# Altium schematic sheet Power_Supplies.SchDoc: =DocumentName
size A4; DocumentNumber: 1; Revision: 0; SheetNumber: 1; SheetTotal: 18; Last modified by: Maciej Przybysz
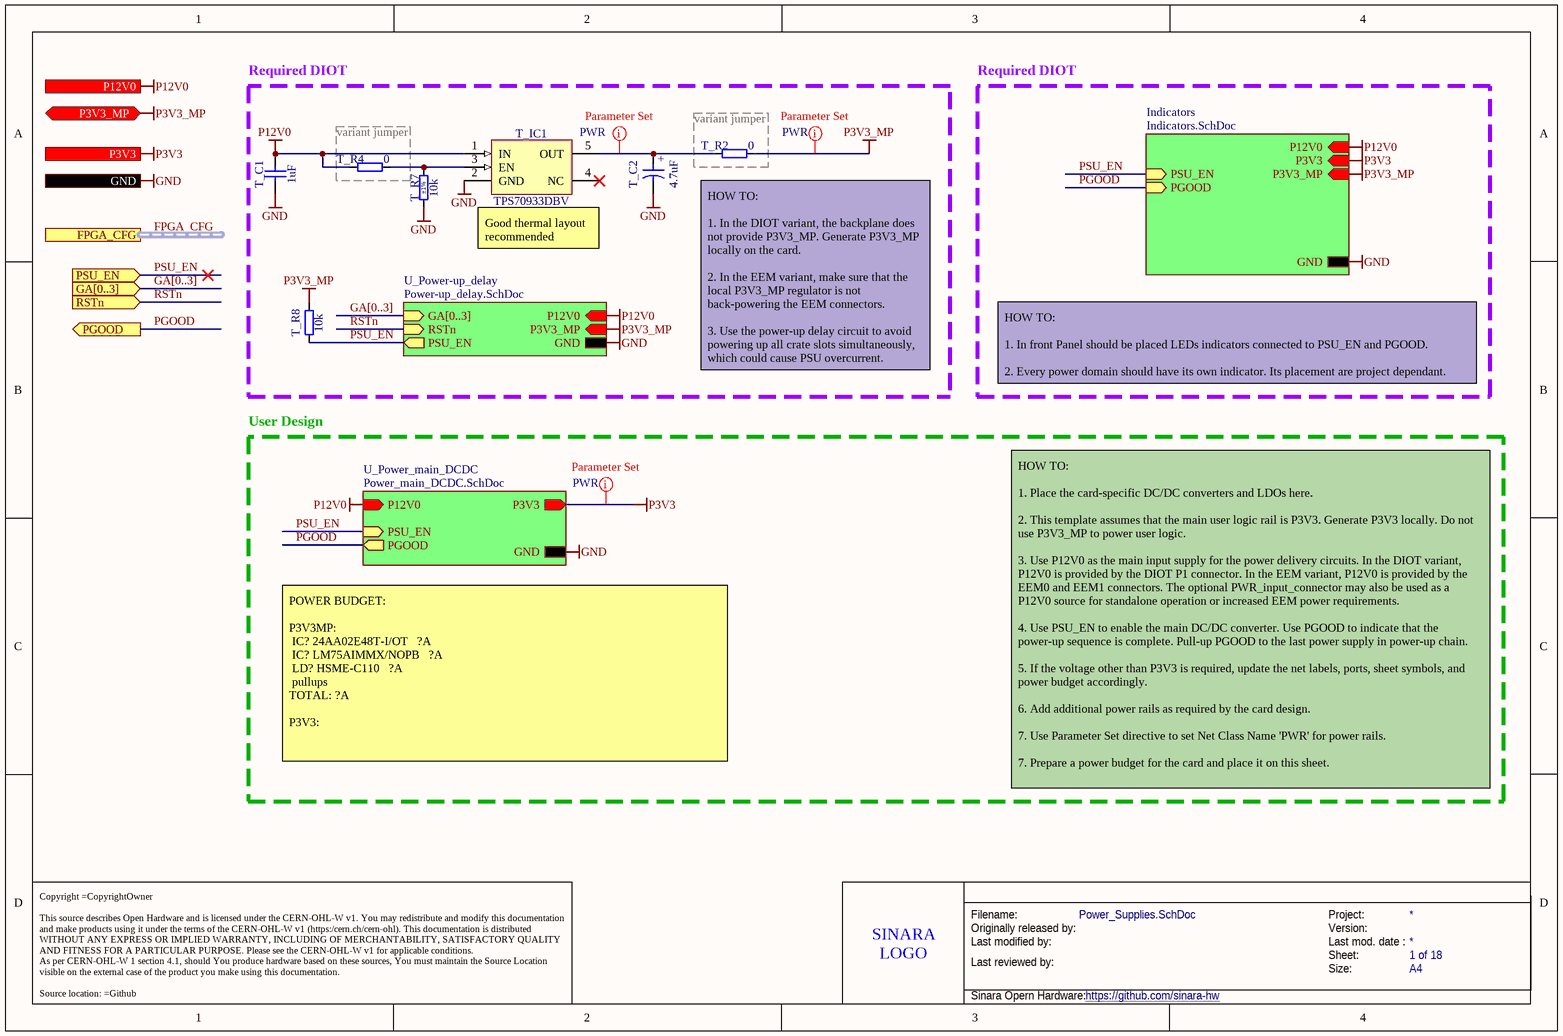
[diagram p0: Power_Supplies.SchDoc]

## Parts
T_C1  1uF  [CAPC1608X87N]
T_C2  4.7uF  [CAPMP3216X180N]
T_IC1  TPS70933DBV  [SOT95P280X145-5N]
T_R2  0  [RESC1005X40N]
T_R4  0  [RESC1005X40N]
T_R7  10k  Tolerance: ±1%  [RESC1005X40N]
T_R8  10k  [RESC1608X55N]

## Blocks framed on the sheet
variant jumper: T_R4
variant jumper: T_R2

## Sub-sheets
Indicators = Indicators.SchDoc: PSU_EN (in), PGOOD (in), GND, P3V3_MP (in), P12V0 (in), P3V3 (in)
U_Power-up_delay = Power-up_delay.SchDoc: GA[0..3] (in), RSTn (in), GND, PSU_EN (out), P3V3_MP (in), P12V0 (in)
U_Power_main_DCDC = Power_main_DCDC.SchDoc: P12V0 (in), P3V3 (out), GND, PSU_EN (in), PGOOD (out)

## Ports
FPGA_CFG (harness FPGA_CFG), GA[0..3] (in), GND, P3V3 (out), P3V3_MP (bidir), P12V0 (in), PGOOD (out), PSU_EN (in), RSTn (in)

## Nets
GND: T_C1.1 T_C2.2 T_IC1.2(GND) T_R7.1 ; port GND, sheet U_Power-up_delay/GND, sheet U_Power_main_DCDC/GND, sheet Indicators/GND
P3V3: port P3V3, sheet U_Power_main_DCDC/P3V3, sheet Indicators/P3V3
P3V3_MP: T_R2.2 T_R8.2 ; port P3V3_MP, sheet U_Power-up_delay/P3V3_MP, sheet Indicators/P3V3_MP
P12V0: T_C1.2 T_IC1.1(IN) T_R4.1 ; port P12V0, sheet U_Power-up_delay/P12V0, sheet U_Power_main_DCDC/P12V0, sheet Indicators/P12V0
PGOOD: port PGOOD, sheet U_Power_main_DCDC/PGOOD, sheet Indicators/PGOOD
PSU_EN: T_R8.1 ; port PSU_EN, sheet U_Power-up_delay/PSU_EN, sheet U_Power_main_DCDC/PSU_EN, sheet Indicators/PSU_EN
RSTn: port RSTn, sheet U_Power-up_delay/RSTn
NetT_C2_1: T_C2.1 T_IC1.5(OUT) T_R2.1
NetT_IC1_3: T_IC1.3(EN) T_R4.2 T_R7.2

Not connected (* = marked no-connect by the designer): T_IC1 4(NC)*

## Buses and harness runs
bus GA[0..3] = port GA[0..3]
bus GA[0..3] = sheet U_Power-up_delay/GA[0..3]
harness FPGA_CFG = port FPGA_CFG

## Layout directives
net class PWR: NetT_C2_1, P3V3, P3V3_MP

## Notes on the sheet
- Required DIOT
- (near T_IC1) Good thermal layout recommended
- (near T_R2) HOW TO:
  1. In the DIOT variant, the backplane does not provide P3V3_MP. Generate P3V3_MP locally on the card.
  2. In the EEM variant, make sure that the local P3V3_MP regulator is not back-powering the EEM connectors.
  3. Use the power-up delay circuit to avoid powering up all crate slots simultaneously, which could cause PSU overcurrent.
- HOW TO:
  1. In front Panel should be placed LEDs indicators connected to PSU_EN and PGOOD.
  2. Every power domain should have its own indicator. Its placement are project dependant.
- User Design
- POWER BUDGET:
  P3V3MP:
  IC?	24AA02E48T-I/OT			?A
  IC?	LM75AIMMX/NOPB			?A
  LD?	HSME-C110			?A
  pullups
  TOTAL: ?A
  P3V3:
- HOW TO:
  1. Place the card-specific DC/DC converters and LDOs here.
  2. This template assumes that the main user logic rail is P3V3. Generate P3V3 locally. Do not use P3V3_MP to power user logic.
  3. Use P12V0 as the main input supply for the power delivery circuits. In the DIOT variant, P12V0 is provided by the DIOT P1 connector. In the EEM variant, P12V0 is provided by the EEM0 and EEM1 connectors. The optional PWR_input_connector may also be used as a P12V0 source for standalone operation or increased EEM power requirements.
  4. Use PSU_EN to enable the main DC/DC converter. Use PGOOD to indicate that the power-up sequence is complete. Pull-up PGOOD to the last power supply in power-up chain.
  5. If the voltage other than P3V3 is required, update the net labels, ports, sheet symbols, and power budget accordingly.
  6. Add additional power rails as required by the card design.
  7. Use Parameter Set directive to set Net Class Name 'PWR' for power rails.
  7. Prepare a power budget for the card and place it on this sheet.
- Filename:
- Project:
- SINARA
  LOGO
  TBD
- Originally released by:
- Last modified by:
- Last reviewed by:
- Size:
- Version:
- Last mod. date :
- Sheet:
- A4
- Copyright =CopyrightOwner
  This source describes Open Hardware and is licensed under the CERN-OHL-W v1. You may redistribute and modify this documentation and make products using it under the terms of the CERN-OHL-W v1 (https:/cern.ch/cern-ohl). This documentation is distributed WITHOUT ANY EXPRESS OR IMPLIED WARRANTY, INCLUDING OF MERCHANTABILITY, SATISFACTORY QUALITY AND FITNESS FOR A PARTICULAR PURPOSE. Please see the CERN-OHL-W v1 for applicable conditions.
  As per CERN-OHL-W 1 section 4.1, should You produce hardware based on these sources, You must maintain the Source Location visible on the external case of the product you make using this documentation.
  Source location: =Github
- Sinara Opern Hardware:
- https://github.com/sinara-hw
- (in symbol CTE3216-18_4.7UF_10V_10%_AVX_TPSA475K010T1400) +

## Library data of the parts
T_C1 = CC0603_1UF_25V_10%_X7R: Non-polarised capacitor; Part Description: SMD Multilayer Chip Ceramic Capacitor; Manufacturer: GENERIC; Manufacturer1 Part Number: GRM188R71E105KA12D; Voltage: 25V; TC: X7R; Tolerance: ±10%; Part Number: CC0603_1UF_25V_10%_X7R; Component Kind: Standard; Component Type: Standard; Pin Count: 2; Value: 1uF; Status: None; Manufacturer Part Number: CC0603_1UF_25V_10%_X7R; Case: 0603; Mounted: Yes; Socket: No; SMD: Yes; Sense: No; Manufacturer1 Example: MURATA; Manufacturer1 ComponentHeight: 0.9mm; HelpURL: \\cern.ch\dfs\Applications\Altium\Datasheets\CC0603_X7R_MURATA.pdf; Author: CERN DEM JLC; CreateDate: 18.01.2011; LatestRevisionDate: 18.01.2011
T_C2 = CTE3216-18_4.7UF_10V_10%_AVX_TPSA475K010T1400: Polarised capacitor; Part Description: Low ESR 1R4 Automotive Solid Tantalum Chip Capacitor; Manufacturer: AVX; Voltage: 10V; Tolerance: ±10%; Part Number: CTE3216-18_4.7UF_10V_10%_AVX_TPSA475K010T1400; Component Kind: Standard; Component Type: Standard; Pin Count: 2; Value: 4.7uF; Status: Preferred; Manufacturer Part Number: TPSA475K010T1400; Case: A; Mounted: Yes; Socket: No; SMD: Yes; Sense: No; ComponentHeight: 1.8mm; HelpURL: \\cern.ch\dfs\Applications\Altium\Datasheets\CTE-LESR_AVX_TPS-AUTO.pdf; Author: CERN DEM JLC; CreateDate: 23.01.2018; LatestRevisionDate: 23.01.2018
T_IC1 = TPS70933DBV: 150-mA, 30-V, 1-µA IQ Voltage Regulators with Enable; Part Description: 3.3V, 150-mA, 30-V, 1-µA IQ Voltage Regulators with Enable; Manufacturer: TEXAS INSTRUMENTS; PressFit: No; Bonding: No; Part Number: TPS70933DBV; Component Kind: Standard; Component Type: Standard; Device: TPS70933DBV; PackageDescription: SOT23, 0.95mm Pitch; 5 Pin, 1.60mm W X 2.90mm L X 1.45mm H body, IPC Medium Density; Manufacturer Part Number: TPS70933DBV; Pin Count: 5; Case: SOT23-5; Mounted: Yes; Socket: No; SMD: Yes; Sense: No; ComponentHeight: 1.45mm; HelpURL: \\cern.ch\dfs\Applications\Altium\Datasheets\TPS709.pdf; Author: CERN DEM JLC; CreateDate: 17.03.2011; LatestRevisionDate: 17.03.2011
T_R2 T_R4 = R0402_0R_JUMPER: Resistor; Part Description: 1A (0.05R Max DC Resistance) Zero Ohm Jumper; Manufacturer: GENERIC; Manufacturer1 Part Number: 232270591001L; PressFit: No; Part Number: R0402_0R_JUMPER; Component Kind: Standard; Component Type: Standard; Pin Count: 2; Value: 0; Status: Not Recommended; Manufacturer Part Number: R0402_0R_JUMPER; Case: 0402; Mounted: Yes; Sense: No; Socket: No; SMD: Yes; Manufacturer1 Example: YAGEO PHYCOMP; Manufacturer1 ComponentHeight: 0.4mm; HelpURL: \\cern.ch\dfs\Applications\Altium\Datasheets\R0402_Phycomp_RC0402.pdf; Author: CERN DEM JLC; CreateDate: 03.12.2007; LatestRevisionDate: 17.10.2012
T_R7 = R0402_10K_1%_0.0625W_100PPM: Resistor - 1%; Part Description: General Purpose Thick Film Chip Resistor; Manufacturer: GENERIC; Manufacturer1 Part Number: 232270671003L; TC: ±100ppm/°C; PressFit: No; Part Number: R0402_10K_1%_0.0625W_100PPM; Component Kind: Standard; Component Type: Standard; Pin Count: 2; Value: 10k; Status: Not Recommended; Power: 0.0625W; Manufacturer Part Number: R0402_10K_1%_0.0625W_100PPM; Case: 0402; Mounted: Yes; Sense: No; Socket: No; SMD: Yes; Manufacturer1 Example: YAGEO PHYCOMP; Manufacturer1 ComponentHeight: 0.4mm; HelpURL: \\cern.ch\dfs\Applications\Altium\Datasheets\R0402_Phycomp_RC0402.pdf; Author: CERN DEM JLC; CreateDate: 03.12.2007; LatestRevisionDate: 17.10.2012
T_R8 = R0603_10K_1%_0.1W_100PPM: Resistor - 1%; Part Description: General Purpose Thick Film Chip Resistor; Manufacturer: GENERIC; Manufacturer1 Part Number: NRC06F1002TRF; Power: 0.1W; TC: ±100ppm/°C; PressFit: No; Part Number: R0603_10K_1%_0.1W_100PPM; Component Kind: Standard; Component Type: Standard; Pin Count: 2; Value: 10k; Status: Preferred; Tolerance: ±1%; Manufacturer Part Number: R0603_10K_1%_0.1W_100PPM; Case: 0603; Mounted: Yes; Sense: No; Socket: No; SMD: Yes; Manufacturer1 Example: NIC COMPONENT; Manufacturer1 ComponentHeight: 0.55mm; HelpURL: \\cern.ch\dfs\Applications\Altium\Datasheets\R0603_NIC_NRC.pdf; Author: CERN DEM JLC; CreateDate: 03.12.2007; LatestRevisionDate: 13.03.2008